# Altium schematic sheet IsoSPI V0.1.SchDoc
size A4; SheetNumber: 3; SheetTotal: 6
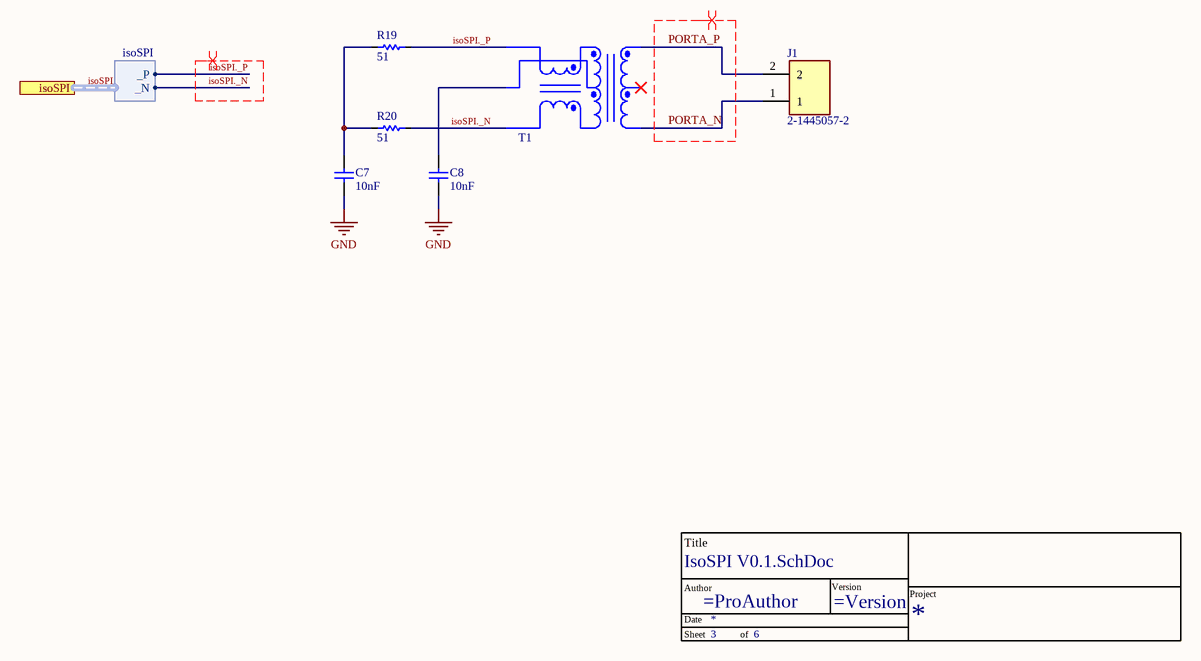
[diagram p0: IsoSPI V0.1.SchDoc]

## Parts
*  TitleBlock  (value not drawn)  (graphical)
C7  value 10nF  [C-0402]  (hidden comment: C)
C8  value 10nF  [C-0402]  (hidden comment: C)
J1  2-1445057-2  [TE_2-1445057-2]
R19  value 51  [R_0402]  (hidden comment: Resistor)
R20  value 51  [R_0402]  (hidden comment: Resistor)
T1  SM91502ALE  [SM91502ALE]  (value not drawn)

## Ports
isoSPI (harness isoSPI)

## Harnesses
isoSPI: _P, _N

## Nets
GND: C7.1 C8.1
isoSPI._N: R20.2 T1.4 ; port isoSPI._N
isoSPI._P: R19.2 T1.6 ; port isoSPI._P
PORTA_N: J1.1 T1.3
PORTA_P: J1.2 T1.1
NetC7_2: C7.2 R19.1 R20.1
NetC8_2: C8.2 T1.5

Not connected (* = marked no-connect by the designer): T1 2*

## Buses and harness runs
harness isoSPI = port isoSPI

## Layout directives
differential pair; differential pair class isoSPI: isoSPI._N, isoSPI._P, PORTA_N, PORTA_P

## Notes on the sheet
- (in symbol TitleBlock) Title; Author; Version; Project; Date; Sheet; of

## Library data of the parts
C7 C8 = Capacitor: ComponentLink1Description: New link; ComponentLink1URL: *
J1 = 2-1445057-2: CONN HEADER 3MM 2POS R/A TIN SMD; MF: {'manufacturer': u'TE Connectivity'}; Package: None; MP: 2-1445057-2; Availability: Unavailable; Price: None; Value: *
T1 = SM91502ALE: BMS XFORMER 1-CH 1000V AECQ +125; Manufacturer: Bourns; Inductance: 150uH; Turns Ratio: 1:1; Supplier 1: RSComponents; Manufacturer Part Number: SM91502ALE; RoHS: Yes; Category: Transformers; Stock 1: 1; Pricing 1: 800=2.35100 (USD); Mount: Surface Mount; Min Operating Temperature: -40°C; Max Operating Temperature: 125°C; Packaging: Cut Tape; ComponentLink1URL: https://www.bourns.com/docs/Product-Datasheets/SM91502AL.pdf?src-supplier=Digi-Key; ComponentLink1Description: https://www.bourns.com/docs/Product-Datasheets/SM91502AL.pdf?src-supplier=Digi-Key; Supplier Part Number 1: 1802382